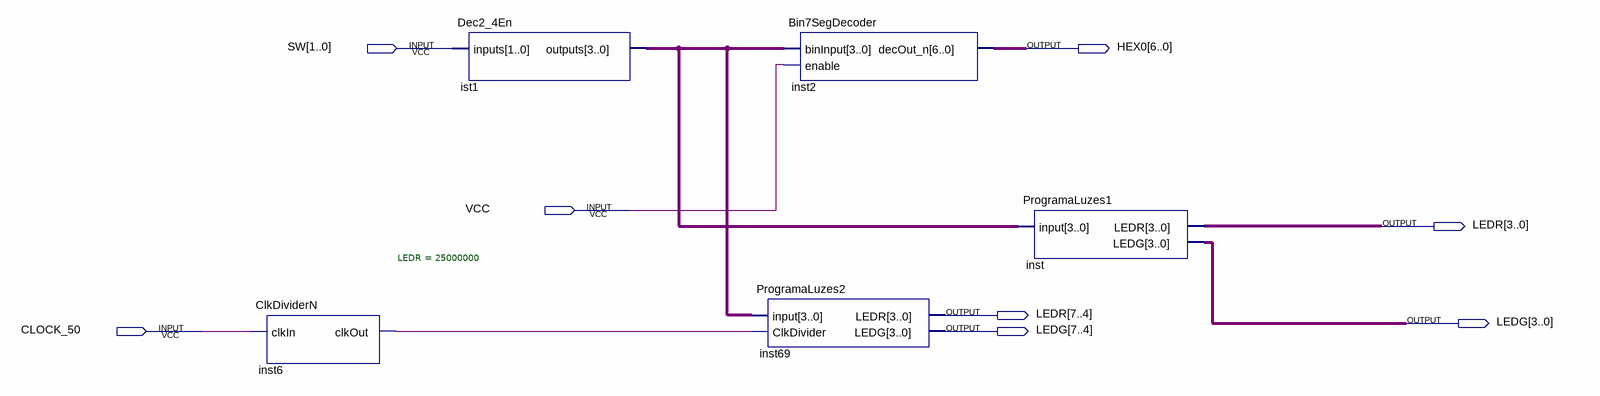
[diagram p0: schematic sheet]
// Quartus schematic projeto1.bdf as structural Verilog: 5 symbols, 8 pins
module projeto1 (
  input  [1:0] SW,
  input  VCC,
  input  CLOCK_50,
  output [6:0] HEX0,
  output [7:0] LEDR,
  output [7:0] LEDG
);

  wire inst6_clkout;
  wire [3:0] ist1_outputs;

  ClkDividerN #(.LEDR(25000000)) inst6 (.clkIn(CLOCK_50), .clkOut(inst6_clkout));
  Dec2_4En ist1 (.inputs(SW), .outputs(ist1_outputs));
  Bin7SegDecoder inst2 (.binInput(ist1_outputs), .enable(VCC), .decOut_n(HEX0));
  ProgramaLuzes2 inst69 (.\input (ist1_outputs), .ClkDivider(inst6_clkout), .LEDR(LEDR[7:4]), .LEDG(LEDG[7:4]));
  ProgramaLuzes1 inst (.\input (ist1_outputs), .LEDR(LEDR[3:0]), .LEDG(LEDG[3:0]));
endmodule
